# EAGLE design rapidshark-half-assed-half-h-bridge-mk-1.2 (EAGLE 7.5.0)
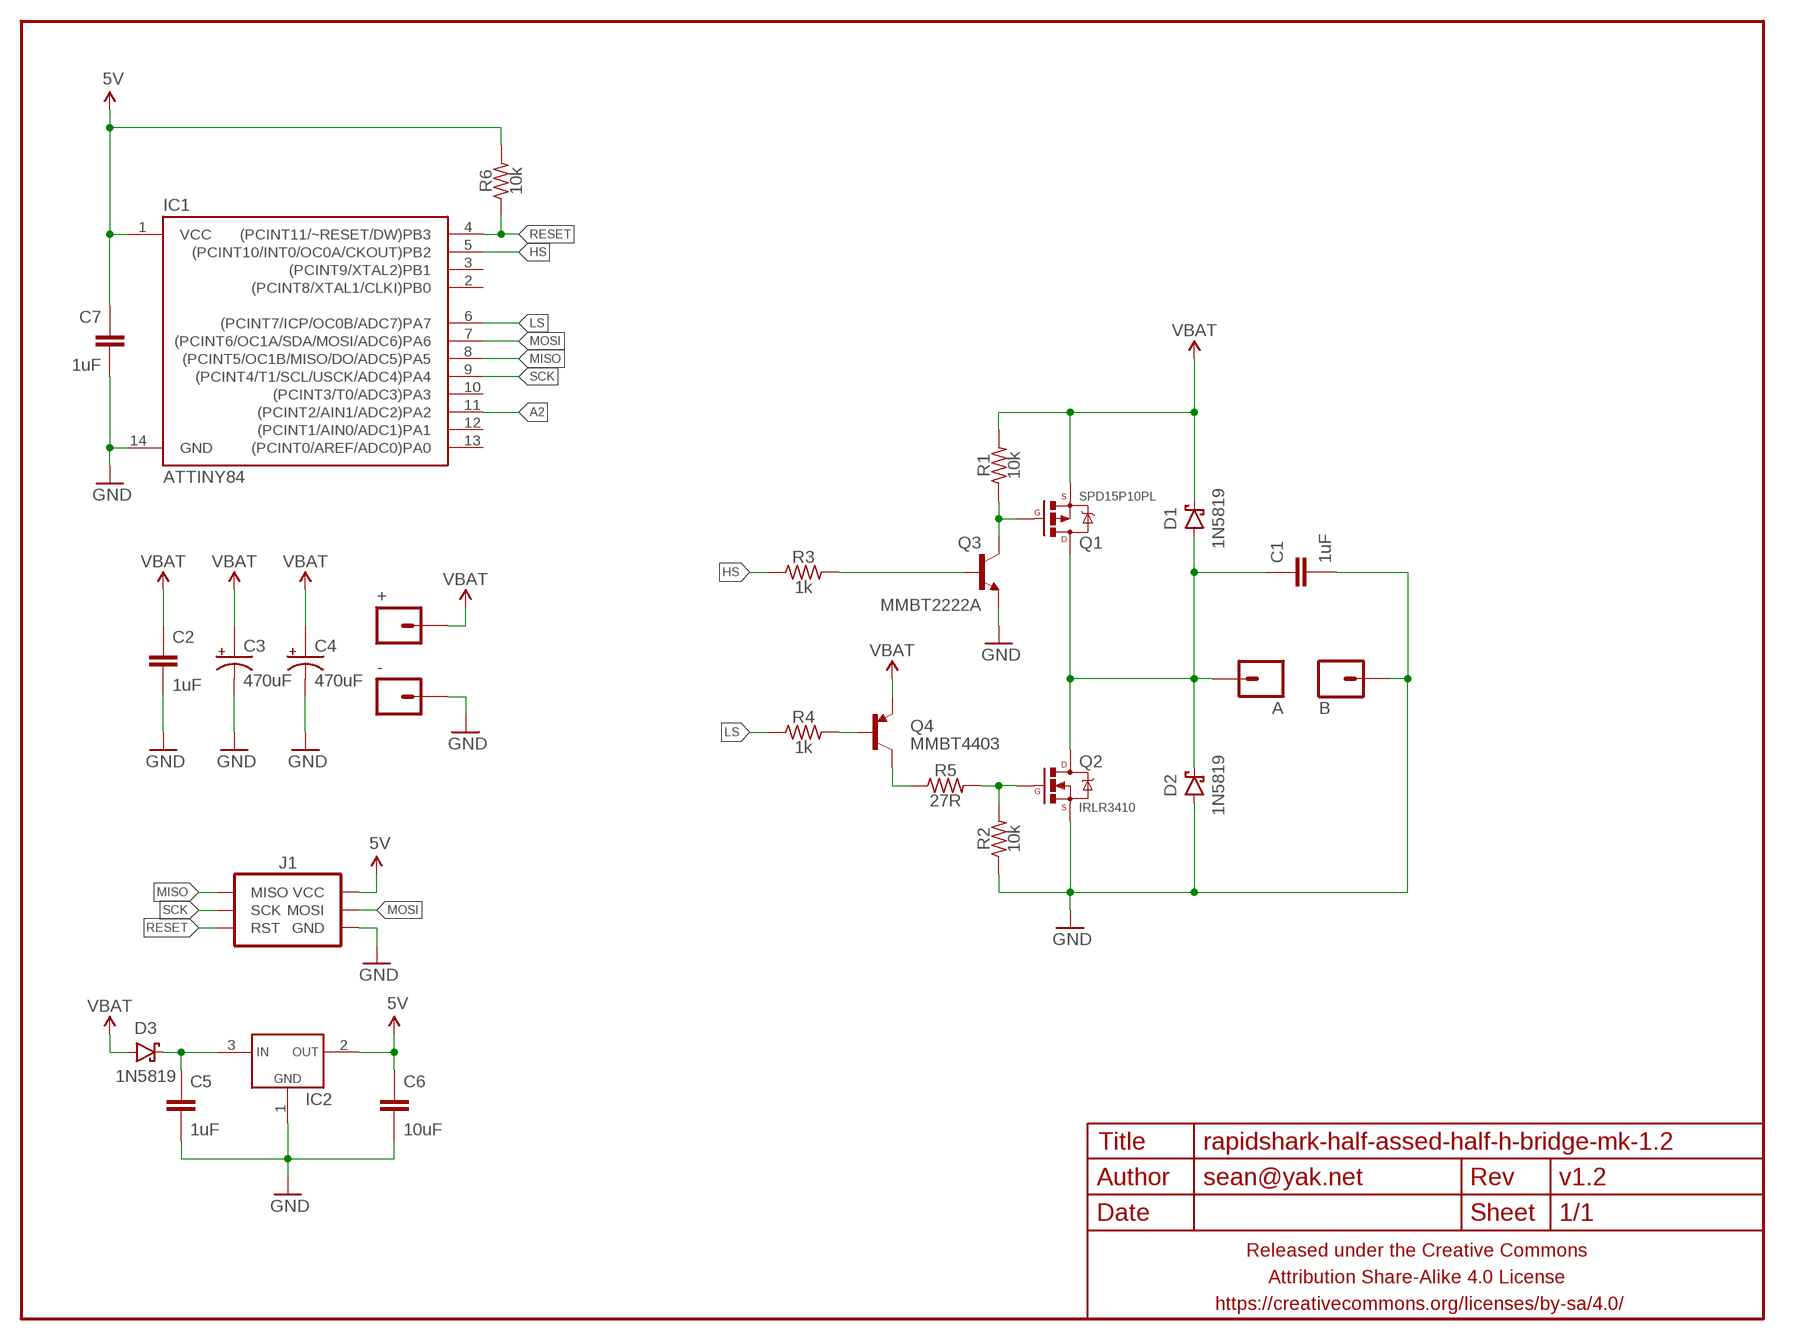
[diagram p0: schematic, sheet 1]

## Parts
+  M01PTH-1.4MM  [1X01-1.4MM-CIR]
-  M01PTH-1.4MM  [1X01-1.4MM-CIR]
A  M01PTH-1.4MM  [1X01-1.4MM-CIR]
B  M01PTH-1.4MM  [1X01-1.4MM-CIR]
C1  1uF  CAPACITOR-CERAMICC0603-TIGHTER  [C0603-TIGHTER]
C2  1uF  CAPACITOR-CERAMICC0603-TIGHTER  [C0603-TIGHTER]
C3  470uF  CAPACITOR-POLARIZEDE5-10.5  [E5-10,5]
C4  470uF  CAPACITOR-POLARIZEDE5-10.5  [E5-10,5]
C5  1uF  CAPACITOR-CERAMICC0805-TIGHTER  [C0805-TIGHTER]
C6  10uF  CAPACITOR-CERAMICC0805-TIGHTER  [C0805-TIGHTER]
C7  1uF  CAPACITOR-CERAMICC0603-TIGHTER  [C0603-TIGHTER]
D1  1N5819  DIODE-SCHOTTKYSMA  [SMA-DIODE-SCHOTTKY]
D2  1N5819  DIODE-SCHOTTKYSMA  [SMA-DIODE-SCHOTTKY]
D3  1N5819  DIODE-SCHOTTKYSOD323  [SOD323-SCHOTTKY]
FRAME1  FRAME-LETTERNO_PACKAGE  [DUMMY]
IC1  ATTINY84  [SO14]
IC2  VREG_1117SOT-23  [SOT23]
J1  AVR_SPI_PRG_6INLINE  [AVR_MINI_PROG]
Q1  SPD15P10PL  MOSFET-PCHANNELDPAK  [DPAK]
Q2  IRLR3410  MOSFET-NCHANNELFDD8780  [DPAK]
Q3  MMBT2222A  TRANSISTOR_NPNMMBT2222A  [SOT23]
Q4  MMBT4403  TRANSISTOR_PNPMMBT4403  [SOT23]
R1  10k  RESISTORR0603-TIGHTER  [R0603-TIGHTER]
R2  10k  RESISTORR0603-TIGHTER  [R0603-TIGHTER]
R3  1k  RESISTORR0603-TIGHTER  [R0603-TIGHTER]
R4  1k  RESISTORR0603-TIGHTER  [R0603-TIGHTER]
R5  27R  RESISTORR0603-TIGHTER  [R0603-TIGHTER]
R6  10k  RESISTORR0603-TIGHTER  [R0603-TIGHTER]

## Nets
5V: C6.1 C7.1 IC1.1(VCC) IC2.2(VOUT) J1.2(VCC) R6.2
A: A.P$1 C1.1 D1.A D2.C Q1.4(D) Q2.4(D)
A2: IC1.11((PCINT2/AIN1/ADC2)PA2)
GND: -.P$1 B.P$1 C1.2 C2.2 C3.- C4.- C5.2 C6.2 C7.2 D2.A IC1.14(GND) IC2.1(GND) J1.6(GND) Q2.3(S) Q3.2(E) R2.1
HS: IC1.5((PCINT10/INT0/OC0A/CKOUT)PB2) R3.1
LS: IC1.6((PCINT7/ICP/OC0B/ADC7)PA7) R4.1
MISO: IC1.8((PCINT5/OC1B/MISO/DO/ADC5)PA5) J1.1(MISO)
MOSI: IC1.7((PCINT6/OC1A/SDA/MOSI/ADC6)PA6) J1.4(MOSI)
N$1: Q1.1(G) Q3.3(C) R1.1
N$2: Q2.1(G) R2.2 R5.2
N$3: Q3.1(B) R3.2
N$4: Q4.1(B) R4.2
N$5: Q4.3(C) R5.1
N$6: C5.1 D3.C IC2.3(VIN)
RESET: IC1.4((PCINT11/~RESET/DW)PB3) J1.5(RST) R6.1
SCK: IC1.9((PCINT4/T1/SCL/USCK/ADC4)PA4) J1.3(SCK)
VBAT: +.P$1 C2.1 C3.+ C4.+ D1.C D3.A Q1.3(S) Q4.2(E) R1.2
Unconnected: IC1.2((PCINT8/XTAL1/CLKI)PB0) IC1.3((PCINT9/XTAL2)PB1) IC1.10((PCINT3/T0/ADC3)PA3) IC1.12((PCINT1/AIN0/ADC1)PA1) IC1.13((PCINT0/AREF/ADC0)PA0)

## Library data of the parts
+ - A B = a_parts:M01: Header 1 Standard 1-pin 0.1" header. Use with straight break away headers (SKU : PRT-00116), right angle break away headers (PRT-00553), swiss pins (PRT-00743), machine pins (PRT-00117), and female headers (PRT-00115).
C1 C2 C5-C7 = a_parts:CAPACITOR-CERAMIC: CAPACITOR, European symbol
C3 C4 = a_parts:CAPACITOR-POLARIZED: POLARIZED CAPACITOR, American symbol
D1-D3 = a_parts:DIODE-SCHOTTKY: Schottky diodes in SFE's production catalog BAT20J 1A 23V 0.62Vf RB751 120mA 40V 0.37Vf PMEG4005EJ 0.5A 40V 0.42Vf MBRA140 1A 40V 0.5Vf B340A 3A 40V SMA
FRAME1 = A_butts:FRAME-LETTER: Schematic Frame Standard 8.5x11 US Letter frame; DESIGNER: sean@yak.net; VERSION: v1.2
IC1 = a_parts:ATTINY84: Atmel 14-pin 2/4/8kB flash uC
IC2 = a_parts:VREG_1117
J1 = a_parts:AVR_SPI_PRG_6: AVR ISP 6 Pin This is the reduced ISP connector for AVR programming. Common on Arduino. This footprint will take up less PCB space and can be used with a 10-pin to 6-pin adapter such as SKU: BOB-08508 **Special note about "TEST_POINT" package. The stop mask is on the top side, so if you want your programming test points to be on the bottom of your board, make sure to place this package on the bottom side of the board. This also ensure that the orientation to program from the bottom side will be correct.
Q1 = a_parts:MOSFET-PCHANNEL: Generic PMOSFET IRLML2244 - TRANS-11153 (SOT-23 -20V -4.3A) (1.Gate 2.Source 3.Drain) FQP27P06 - COM-10349 <http://www.sparkfun.com/products/10349> (TO-220 -60V -27A) (1.Gate 2.Source 3.Drain)
Q2 = a_parts:MOSFET-NCHANNEL: Common NMOSFET Parts MFG P/N Store ID Prod ID FDD8780 TRANS-09984 SI7820DN TRANS-11055 FDS6630A IC-08089 2N7002PW TRANS-11151 FQP30N06L COM-10213 TRANS-10060 BSS123LT1G TRANS-08345 BSS138 TRANS-00830 BS170 2N7000; PROD_ID: TRANS-09984
Q3 = a_parts:TRANSISTOR_NPN: Generic NPN BJT MMBT2222A - TRANS-08049 (SOT-23, 1A 40V) MPSA42 - TRANS-09116 (SOT-23, 500mA 300V) MMBT5088LT1G - TRANS-11160 (SOT-23, 50 mA 30V) BC547 - COM-08928 <http://www.sparkfun.com/products/8928> (TO-92 45V 100mA) (1.Collector 2.Base 3.Emitter) 2N3904 - COM-00521 <http://www.sparkfun.com/products/521> (TO-92 40V 200mA) (1.Emitter 2.Base 3.Collector) P2N2222A - COM-12852 <http://www.sparkfun.com/products/12852> (TO-92 40V 600mA) (1.Collector 2.Base 3.Emitter)
Q4 = a_parts:TRANSISTOR_PNP: Generic PNP BJT Double check pinouts against datasheets- not all devices are the same! MMBT3906 - 40V 200mA SOT-23 (TRANS-08052) MMBT4403 - 40V 600mA SOT-23 (TRANS-09245); PROD_ID: TRANS-09245
R1-R6 = a_parts:RESISTOR: RESISTOR, American symbol

## Board
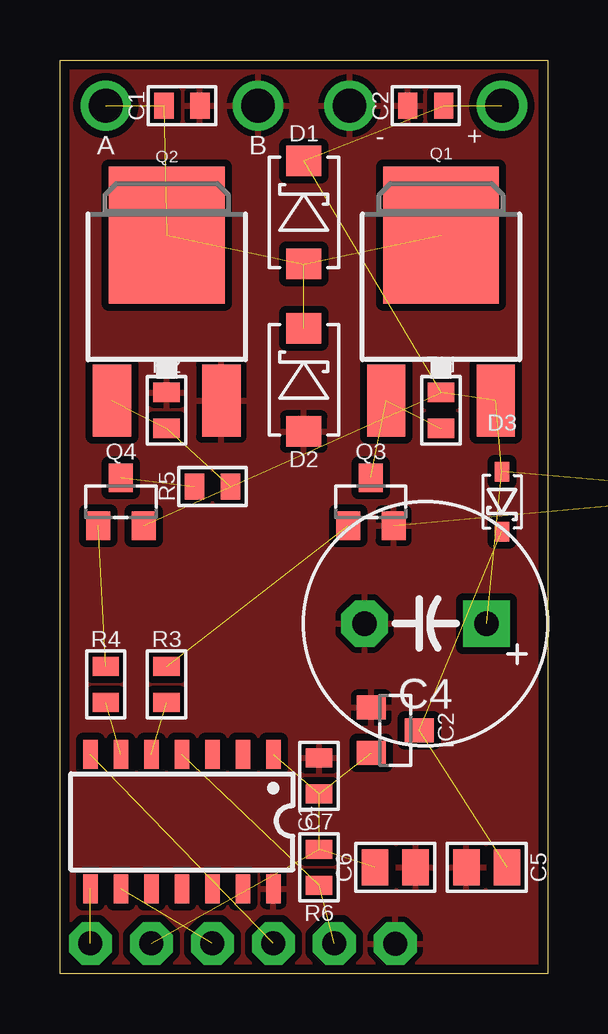
[diagram p1: board, top side]
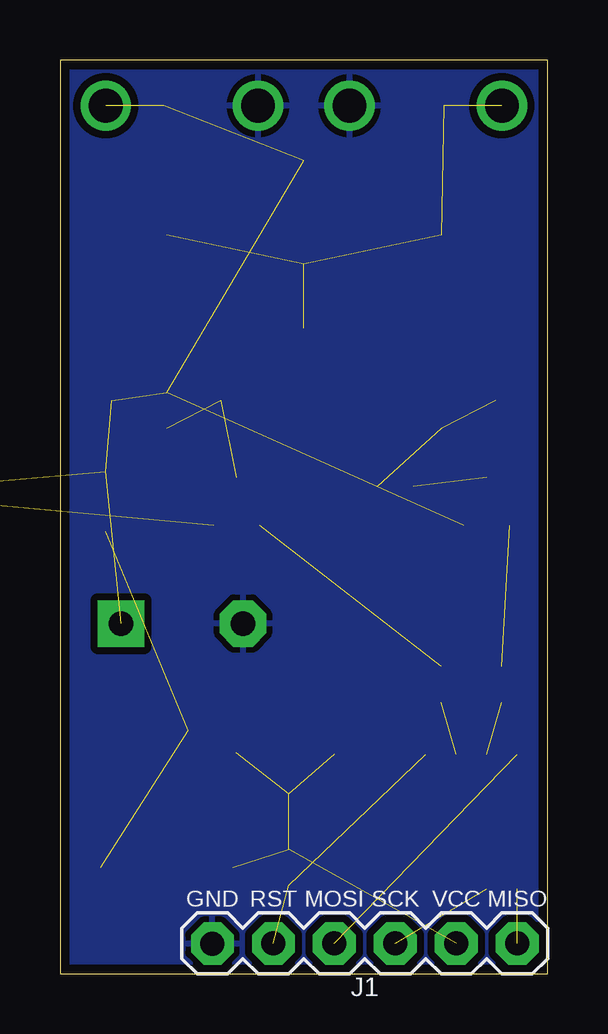
[diagram p2: board, bottom side, seen from below]

Size 20.32 x 38.1 mm. Coordinates in mm from the lower left corner, seen from the top.
Outline: 20.32,0 0,0 0,38.1 20.32,38.1 20.32,0
Copper layers (1*16): Top 0.0356mm / dielectric 1.5011mm / Bottom 0.0356mm
Design rules "LaenPCBOrder_2": minimum track width 6mil, minimum drill 13mil, track to track 6mil, track to pad 6mil, pad to pad 6mil, via to via 6mil, smd to smd 6mil, copper to edge 15mil, drill to drill 6mil, minimum pad ring 7mil, minimum via ring 7mil, stop-mask expansion 3mil, vias tented up to drill 20mil, thermal gap 10mil

### Footprints (pad centres in the part's own frame; a part is rotated, then mirrored left to right if it is on the bottom)
1X01-1.4MM-CIR = drill 1.4 pad 2.1: P$1 0,0
C0603-TIGHTER = smd 0.8 x 1.1: 1 -0.75,0; 2 0.75,0
E5-10,5 = drill 1.016 pad 1.93 square: + -2.54,0 | drill 1.016 pad 1.93 octagon: - 2.54,0
C0805-TIGHTER = smd 1.1 x 1.5: 1 -0.85,0; 2 0.85,0
SMA-DIODE-SCHOTTKY = smd 1.27 x 1.47: A -2.15,0; C 2.15,0
SOD323-SCHOTTKY = smd 0.8 x 0.6: A -1.25,0; C 1.25,0
SO14 = smd 0.6 x 1.2: 1 -3.81,-2.8; 2 -2.54,-2.8; 3 -1.27,-2.8; 4 0,-2.8; 5 1.27,-2.8; 6 2.54,-2.8; 7 3.81,-2.8; 8 3.81,2.8; 9 2.54,2.8; 10 1.27,2.8; 11 0,2.8; 12 -1.27,2.8; 13 -2.54,2.8; 14 -3.81,2.8
SOT23 = smd 1 x 1.2: 1 -0.95,-1; 2 0.95,-1; 3 0,1
AVR_MINI_PROG = drill 1 pad 1.778 octagon: 1 -6.35,0; 2 -3.81,0; 3 -1.27,0; 4 1.27,0; 5 3.81,0; 6 6.35,0.01
DPAK = smd 1.6 x 3: 1 -2.28,-5.31; 3 2.28,-5.31 | smd 4.826 x 5.715: 4 0,1.588
R0603-TIGHTER = smd 0.8 x 1.1: 1 -0.75,0; 2 0.75,0

### Placement (x,y rotation side)
+  18.41,36.2 0 top
-  12.06,36.2 0 top
A  1.91,36.2 0 top
B  8.26,36.2 0 bottom
C1  5.08,36.2 0 top
C2  15.24,36.2 180 top
C3  28.7,19.81 180 top  (outside the outline)
C4  15.23,14.61 180 top
C5  17.78,4.45 180 top
C6  13.97,4.45 0 top
C7  10.79,8.26 90 top
D1  10.16,31.75 90 top
D2  10.16,24.77 90 top
D3  18.41,19.68 270 top
FRAME1  0,0 0 bottom
IC1  5.08,6.35 180 top
IC2  13.97,10.16 270 top
J1  7.62,1.27 180 bottom
Q1  15.88,29.21 0 top
Q2  4.45,29.21 0 top
Q3  12.95,19.68 0 top
Q4  2.54,19.68 0 top
R1  15.88,23.5 90 top
R2  4.45,23.5 270 top
R3  4.45,12.06 90 top
R4  1.91,12.06 90 top
R5  6.35,20.32 0 top
R6  10.79,4.45 90 top
U$1  [COW_SMALL_METAL_NOTEXT]  36.83,22.86 0 bottom  (outside the outline)
U$2  [CC-BY-SA-4.0-NO-URL]  36.83,15.88 0 bottom  (outside the outline)
U$3  [OSHWLOGO_TINY_SILKONLY]  41.27,15.88 0 top  (outside the outline)

### Tracks (layer width: path | path; a pad name or v marks a point on that pad's centre or on a via)
5V  (5 unrouted)
A  (5 unrouted)
GND  (1 unrouted)
  pour Bottom (isolate 0.305, rank 5): 20.32,38.1 20.32,0 0,0 0,38.1
  pour Top (isolate 0.305, rank 5): 20.32,38.1 20.32,0 0,0 0,38.1
HS  (1 unrouted)
LS  (1 unrouted)
MISO  (1 unrouted)
MOSI  (1 unrouted)
N$1  (2 unrouted)
N$2  (2 unrouted)
N$3  (1 unrouted)
N$4  (1 unrouted)
N$5  (1 unrouted)
N$6  (2 unrouted)
RESET  (2 unrouted)
SCK  (1 unrouted)
VBAT  (8 unrouted)

### Text on the board
bPlace: Half-Assed / Half Bridge | by schizobovine / <sean@yak.net>